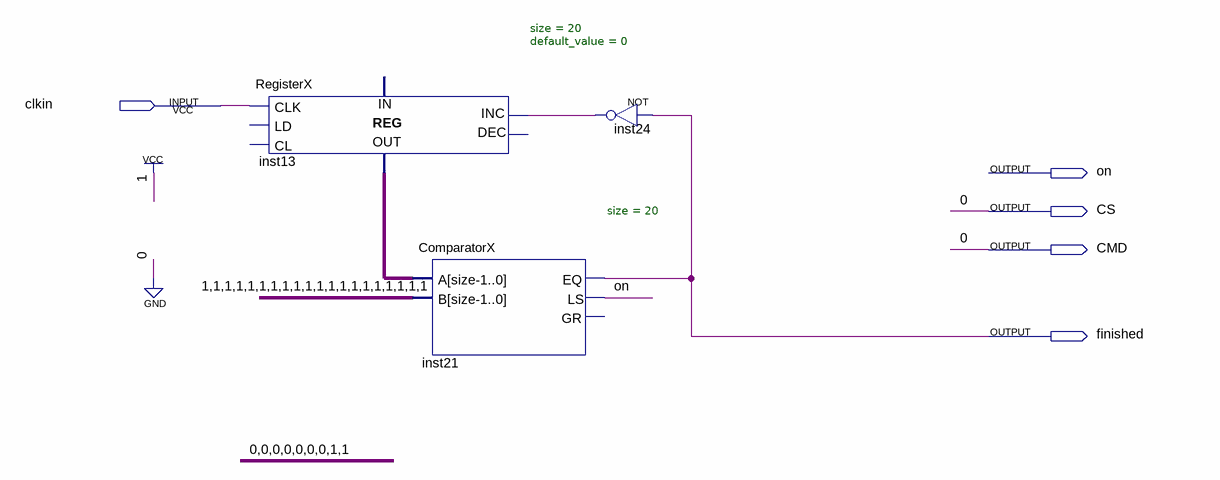
[diagram p0: schematic sheet]
// Quartus schematic delay.bdf as structural Verilog: 3 symbols, 5 pins
module delay (
  input  clkin,
  output on,
  output CS,
  output CMD,
  output finished
);

  wire inst24_out;
  wire [19:0] inst13_data_out;

  RegisterX #(.size(20), .default_value(0)) inst13 (
    .CLK(clkin), .INC(inst24_out), .DATA_OUT(inst13_data_out));  // open: LD, CL, DEC, DATA_IN
  ComparatorX #(.size(20)) inst21 (.A(inst13_data_out), .B({20{1'b1}}), .EQ(finished), .LS(on));  // open: GR
  not inst24 (inst24_out, finished);

  assign CMD = 1'b0;
  assign CS = 1'b0;
endmodule
